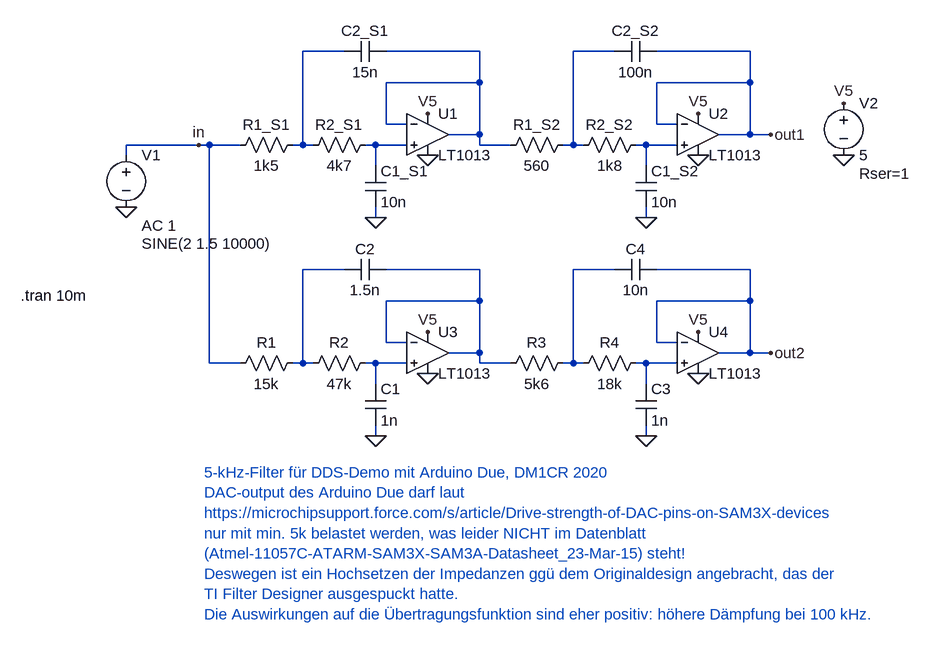
[diagram p0: schematic Filter_5kHz.asc]
Filter_5kHz.asc, the LTspice schematic file:
Version 4
SHEET 1 980 892
WIRE 32 32 -32 32
WIRE 240 32 96 32
WIRE 448 32 384 32
WIRE 656 32 512 32
WIRE 240 80 240 32
WIRE 240 80 96 80
WIRE 656 80 656 32
WIRE 656 80 512 80
WIRE 96 144 96 80
WIRE 128 144 96 144
WIRE 512 144 512 80
WIRE 544 144 512 144
WIRE 240 160 240 80
WIRE 240 160 192 160
WIRE 656 160 656 80
WIRE 656 160 608 160
WIRE 688 160 656 160
WIRE -192 176 -304 176
WIRE -176 176 -192 176
WIRE -128 176 -176 176
WIRE -32 176 -32 32
WIRE -32 176 -48 176
WIRE -16 176 -32 176
WIRE 80 176 64 176
WIRE 128 176 80 176
WIRE 240 176 240 160
WIRE 288 176 240 176
WIRE 384 176 384 32
WIRE 384 176 368 176
WIRE 400 176 384 176
WIRE 496 176 480 176
WIRE 544 176 496 176
WIRE -304 192 -304 176
WIRE 80 208 80 176
WIRE 496 208 496 176
WIRE 80 288 80 272
WIRE 496 288 496 272
WIRE 32 368 -32 368
WIRE 240 368 96 368
WIRE 448 368 384 368
WIRE 656 368 512 368
WIRE 240 416 240 368
WIRE 240 416 96 416
WIRE 656 416 656 368
WIRE 656 416 512 416
WIRE 96 480 96 416
WIRE 128 480 96 480
WIRE 512 480 512 416
WIRE 544 480 512 480
WIRE 240 496 240 416
WIRE 240 496 192 496
WIRE 656 496 656 416
WIRE 656 496 608 496
WIRE 688 496 656 496
WIRE -176 512 -176 176
WIRE -128 512 -176 512
WIRE -32 512 -32 368
WIRE -32 512 -48 512
WIRE -16 512 -32 512
WIRE 80 512 64 512
WIRE 128 512 80 512
WIRE 240 512 240 496
WIRE 288 512 240 512
WIRE 384 512 384 368
WIRE 384 512 368 512
WIRE 400 512 384 512
WIRE 496 512 480 512
WIRE 544 512 496 512
WIRE 80 544 80 512
WIRE 496 544 496 512
WIRE 80 624 80 608
WIRE 496 624 496 608
FLAG 160 192 0
FLAG 160 128 V5
FLAG 80 288 0
FLAG -304 272 0
FLAG 576 192 0
FLAG 576 128 V5
FLAG 496 288 0
FLAG 800 192 0
FLAG 800 112 V5
FLAG 688 160 out1
FLAG -192 176 in
FLAG 160 528 0
FLAG 160 464 V5
FLAG 80 624 0
FLAG 576 528 0
FLAG 576 464 V5
FLAG 496 624 0
FLAG 688 496 out2
SYMBOL Opamps\\LT1013 160 96 R0
SYMATTR InstName U1
SYMBOL res -32 160 R90
WINDOW 0 0 56 VBottom 2
WINDOW 3 32 56 VTop 2
SYMATTR InstName R1_S1
SYMATTR Value 1k5
SYMBOL res 80 160 R90
WINDOW 0 0 56 VBottom 2
WINDOW 3 32 56 VTop 2
SYMATTR InstName R2_S1
SYMATTR Value 4k7
SYMBOL cap 64 208 R0
SYMATTR InstName C1_S1
SYMATTR Value 10n
SYMBOL cap 96 16 R90
WINDOW 0 0 32 VBottom 2
WINDOW 3 32 32 VTop 2
SYMATTR InstName C2_S1
SYMATTR Value 15n
SYMBOL voltage -304 176 R0
WINDOW 3 24 152 Left 2
WINDOW 123 24 124 Left 2
WINDOW 39 0 0 Left 0
SYMATTR InstName V1
SYMATTR Value SINE(2 1.5 10000)
SYMATTR Value2 AC 1
SYMBOL Opamps\\LT1013 576 96 R0
SYMATTR InstName U2
SYMBOL res 496 160 R90
WINDOW 0 0 56 VBottom 2
WINDOW 3 32 56 VTop 2
SYMATTR InstName R2_S2
SYMATTR Value 1k8
SYMBOL cap 480 208 R0
SYMATTR InstName C1_S2
SYMATTR Value 10n
SYMBOL cap 512 16 R90
WINDOW 0 0 32 VBottom 2
WINDOW 3 32 32 VTop 2
SYMATTR InstName C2_S2
SYMATTR Value 100n
SYMBOL res 384 160 R90
WINDOW 0 0 56 VBottom 2
WINDOW 3 32 56 VTop 2
SYMATTR InstName R1_S2
SYMATTR Value 560
SYMBOL voltage 800 96 R0
WINDOW 123 0 0 Left 0
WINDOW 39 24 124 Left 2
SYMATTR InstName V2
SYMATTR Value 5
SYMATTR SpiceLine Rser=1
SYMBOL Opamps\\LT1013 160 432 R0
SYMATTR InstName U3
SYMBOL res -32 496 R90
WINDOW 0 0 56 VBottom 2
WINDOW 3 32 56 VTop 2
SYMATTR InstName R1
SYMATTR Value 15k
SYMBOL res 80 496 R90
WINDOW 0 0 56 VBottom 2
WINDOW 3 32 56 VTop 2
SYMATTR InstName R2
SYMATTR Value 47k
SYMBOL cap 64 544 R0
SYMATTR InstName C1
SYMATTR Value 1n
SYMBOL cap 96 352 R90
WINDOW 0 0 32 VBottom 2
WINDOW 3 32 32 VTop 2
SYMATTR InstName C2
SYMATTR Value 1.5n
SYMBOL Opamps\\LT1013 576 432 R0
SYMATTR InstName U4
SYMBOL res 496 496 R90
WINDOW 0 0 56 VBottom 2
WINDOW 3 32 56 VTop 2
SYMATTR InstName R4
SYMATTR Value 18k
SYMBOL cap 480 544 R0
SYMATTR InstName C3
SYMATTR Value 1n
SYMBOL cap 512 352 R90
WINDOW 0 0 32 VBottom 2
WINDOW 3 32 32 VTop 2
SYMATTR InstName C4
SYMATTR Value 10n
SYMBOL res 384 496 R90
WINDOW 0 0 56 VBottom 2
WINDOW 3 32 56 VTop 2
SYMATTR InstName R3
SYMATTR Value 5k6
TEXT -466 408 Left 2 !.tran 10m
TEXT -184 680 Left 2 ;5-kHz-Filter für DDS-Demo mit Arduino Due, DM1CR 2020\nDAC-output des Arduino Due darf laut\nhttps://microchipsupport.force.com/s/article/Drive-strength-of-DAC-pins-on-SAM3X-devices\nnur mit min. 5k belastet werden, was leider NICHT im Datenblatt\n(Atmel-11057C-ATARM-SAM3X-SAM3A-Datasheet_23-Mar-15) steht!\nDeswegen ist ein Hochsetzen der Impedanzen ggü dem Originaldesign angebracht, das der\nTI Filter Designer ausgespuckt hatte.\nDie Auswirkungen auf die Übertragungsfunktion sind eher positiv: höhere Dämpfung bei 100 kHz.

The netlist it stands for:
* Filter_5kHz.asc
XU1 N004 N002 V5 0 N002 LT1013  ; pins In+ In- V+ V- OUT
R1_S1 N001 in 1k5
R2_S1 N004 N001 4k7
C1_S1 N004 0 10n
C2_S1 N002 N001 15n
V1 in 0 SINE(2 1.5 10000) AC 1
XU2 N005 out1 V5 0 out1 LT1013  ; pins In+ In- V+ V- OUT
R2_S2 N005 N003 1k8
C1_S2 N005 0 10n
C2_S2 out1 N003 100n
R1_S2 N003 N002 560
V2 V5 0 5 Rser=1
XU3 N009 N007 V5 0 N007 LT1013  ; pins In+ In- V+ V- OUT
R1 N006 in 15k
R2 N009 N006 47k
C1 N009 0 1n
C2 N007 N006 1.5n
XU4 N010 out2 V5 0 out2 LT1013  ; pins In+ In- V+ V- OUT
R4 N010 N008 18k
C3 N010 0 1n
C4 out2 N008 10n
R3 N008 N007 5k6
.tran 10m
* 5-kHz-Filter für DDS-Demo mit Arduino Due, DM1CR 2020
* DAC-output des Arduino Due darf laut
* https://microchipsupport.force.com/s/article/Drive-strength-of-DAC-pins-on-SAM3X-devices
* nur mit min. 5k belastet werden, was leider NICHT im Datenblatt
* (Atmel-11057C-ATARM-SAM3X-SAM3A-Datasheet_23-Mar-15) steht!
* Deswegen ist ein Hochsetzen der Impedanzen ggü dem Originaldesign angebracht, das der
* TI Filter Designer ausgespuckt hatte.
* Die Auswirkungen auf die Übertragungsfunktion sind eher positiv: höhere Dämpfung bei 100 kHz.
.lib LTC.lib
.backanno
.end